# Altium schematic sheet Sheet3.SchDoc
size C
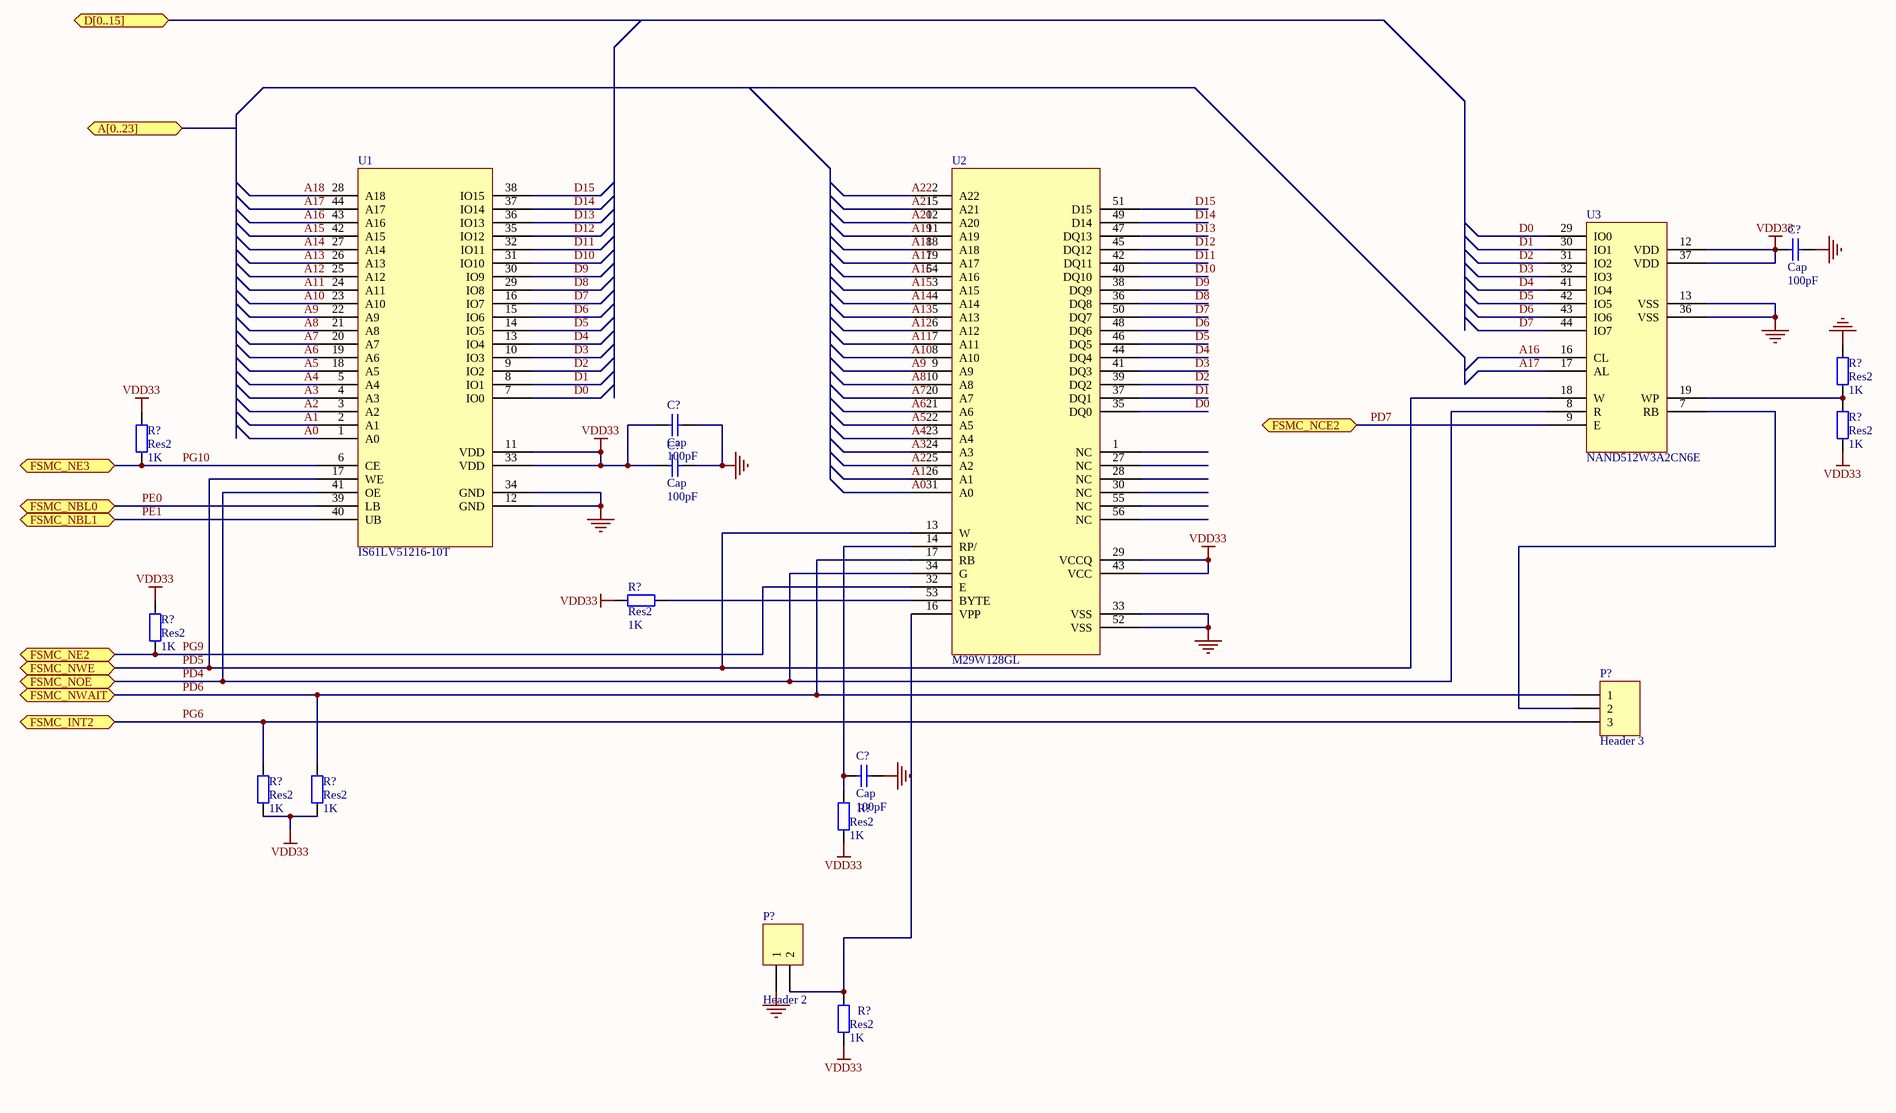
[diagram p0: Sheet3.SchDoc]

## Parts
(Parts that share a designator on the sheet are numbered #1, #2 ... from top to bottom, then left to right.)
C?#1  Cap  value 100pF  [RAD-0.3]
C?#2  Cap  value 100pF  [RAD-0.3]
C?#3  Cap  value 100pF  [RAD-0.3]
C?#4  Cap  value 100pF  [RAD-0.3]
P?#1  Header 3  [HDR1X3]
P?#2  Header 2  [HDR1X2]
R?#1  Res2  value 1K  [AXIAL-0.4]
R?#2  Res2  value 1K  [AXIAL-0.4]
R?#3  Res2  value 1K  [AXIAL-0.4]
R?#4  Res2  value 1K  [AXIAL-0.4]
R?#5  Res2  value 1K  [AXIAL-0.4]
R?#6  Res2  value 1K  [AXIAL-0.4]
R?#7  Res2  value 1K  [AXIAL-0.4]
R?#8  Res2  value 1K  [AXIAL-0.4]
R?#9  Res2  value 1K  [AXIAL-0.4]
U1  IS61LV51216-10T
U2  M29W128GL
U3  NAND512W3A2CN6E

## Ports
A[0..23] (bidir), D[0..15] (bidir), FSMC_INT2 (bidir), FSMC_NBL0 (bidir), FSMC_NBL1 (bidir), FSMC_NCE2 (bidir), FSMC_NE2 (bidir), FSMC_NE3 (bidir), FSMC_NOE (bidir), FSMC_NWAIT (bidir), FSMC_NWE (bidir)

## Nets
GND: C?#1.2 C?#2.2 C?#3.2 C?#4.2 P?#2.1 R?#1.2 U1.12(GND) U1.34(GND) U2.33(VSS) U2.52(VSS) U3.13(VSS) U3.36(VSS)
VDD33: C?#1.1 C?#2.1 C?#3.1 R?#2.1 R?#3.2 R?#4.2 R?#5.2 R?#6.2 R?#7.1 R?#8.1 R?#9.1 U1.11(VDD) U1.33(VDD) U2.29(VCCQ) U2.43(VCC) U3.12(VDD) U3.37(VDD)
A0: U1.1(A0) U2.31(A0)
A1: U1.2(A1) U2.26(A1)
A2: U1.3(A2) U2.25(A2)
A3: U1.4(A3) U2.24(A3)
A4: U1.5(A4) U2.23(A4)
A5: U1.18(A5) U2.22(A5)
A6: U1.19(A6) U2.21(A6)
A7: U1.20(A7) U2.20(A7)
A8: U1.21(A8) U2.10(A8)
A9: U1.22(A9) U2.9(A9)
A10: U1.23(A10) U2.8(A10)
A11: U1.24(A11) U2.7(A11)
A12: U1.25(A12) U2.6(A12)
A13: U1.26(A13) U2.5(A13)
A14: U1.27(A14) U2.4(A14)
A15: U1.42(A15) U2.3(A15)
A16: U1.43(A16) U2.54(A16) U3.16(CL)
A17: U1.44(A17) U2.19(A17) U3.17(AL)
A18: U1.28(A18) U2.18(A18)
A19: U2.11(A19)
A20: U2.12(A20)
A21: U2.15(A21)
A22: U2.2(A22)
D0: U1.7(IO0) U2.35(DQ0) U3.29(IO0)
D1: U1.8(IO1) U2.37(DQ1) U3.30(IO1)
D2: U1.9(IO2) U2.39(DQ2) U3.31(IO2)
D3: U1.10(IO3) U2.41(DQ3) U3.32(IO3)
D4: U1.13(IO4) U2.44(DQ4) U3.41(IO4)
D5: U1.14(IO5) U2.46(DQ5) U3.42(IO5)
D6: U1.15(IO6) U2.48(DQ6) U3.43(IO6)
D7: U1.16(IO7) U2.50(DQ7) U3.44(IO7)
D8: U1.29(IO8) U2.36(DQ8)
D9: U1.30(IO9) U2.38(DQ9)
D10: U1.31(IO10) U2.40(DQ10)
D11: U1.32(IO11) U2.42(DQ11)
D12: U1.35(IO12) U2.45(DQ12)
D13: U1.36(IO13) U2.47(DQ13)
D14: U1.37(IO14) U2.49(D14)
D15: U1.38(IO15) U2.51(D15)
PD4: U1.41(OE) U2.34(G) U3.8(R) ; port FSMC_NOE
PD5: U1.17(WE) U2.13(W) U3.18(W) ; port FSMC_NWE
PD6: P?#1.1 R?#7.2 U2.17(RB) ; port FSMC_NWAIT
PD7: U3.9(E) ; port FSMC_NCE2
PE0: U1.39(LB) ; port FSMC_NBL0
PE1: U1.40(UB) ; port FSMC_NBL1
PG6: P?#1.3 R?#6.1 ; port FSMC_INT2
PG9: R?#5.1 U2.32(E) ; port FSMC_NE2
PG10: R?#3.1 U1.6(CE) ; port FSMC_NE3
NetC?#4_1: C?#4.1 R?#8.2 U2.14(RP/)
NetP?#1_2: P?#1.2 U3.7(RB)
NetP?#2_2: P?#2.2 R?#9.2 U2.16(VPP)
NetR?#1_1: R?#1.1 R?#2.2 U3.19(WP)
NetR?#4_1: R?#4.1 U2.53(BYTE)

Not connected (* = marked no-connect by the designer): U2 1(NC) 27(NC) 28(NC) 30(NC) 55(NC) 56(NC)

## Library data of the parts
C?#1-C?#4 = Cap: Capacitor; Published: 8-Jun-2000; LatestRevisionDate: 17-Jul-2002; LatestRevisionNote: Re-released for DXP Platform.; PackageReference: RAD-0.3; Publisher: Altium Limited
P?#1 = Header 3: Header, 3-Pin; LatestRevisionDate: 17-Jul-2002; LatestRevisionNote: Re-released for DXP Platform.; Publisher: Altium Limited
P?#2 = Header 2: Header, 2-Pin; LatestRevisionDate: 17-Jul-2002; LatestRevisionNote: Re-released for DXP Platform.; Publisher: Altium Limited
R?#1-R?#9 = Res2: Resistor; Published: 8-Jun-2000; LatestRevisionDate: 17-Jul-2002; LatestRevisionNote: Re-released for DXP Platform.; PackageReference: AXIAL-0.4; Publisher: Altium Limited